# Altium schematic sheet Driver.SchDoc
size A
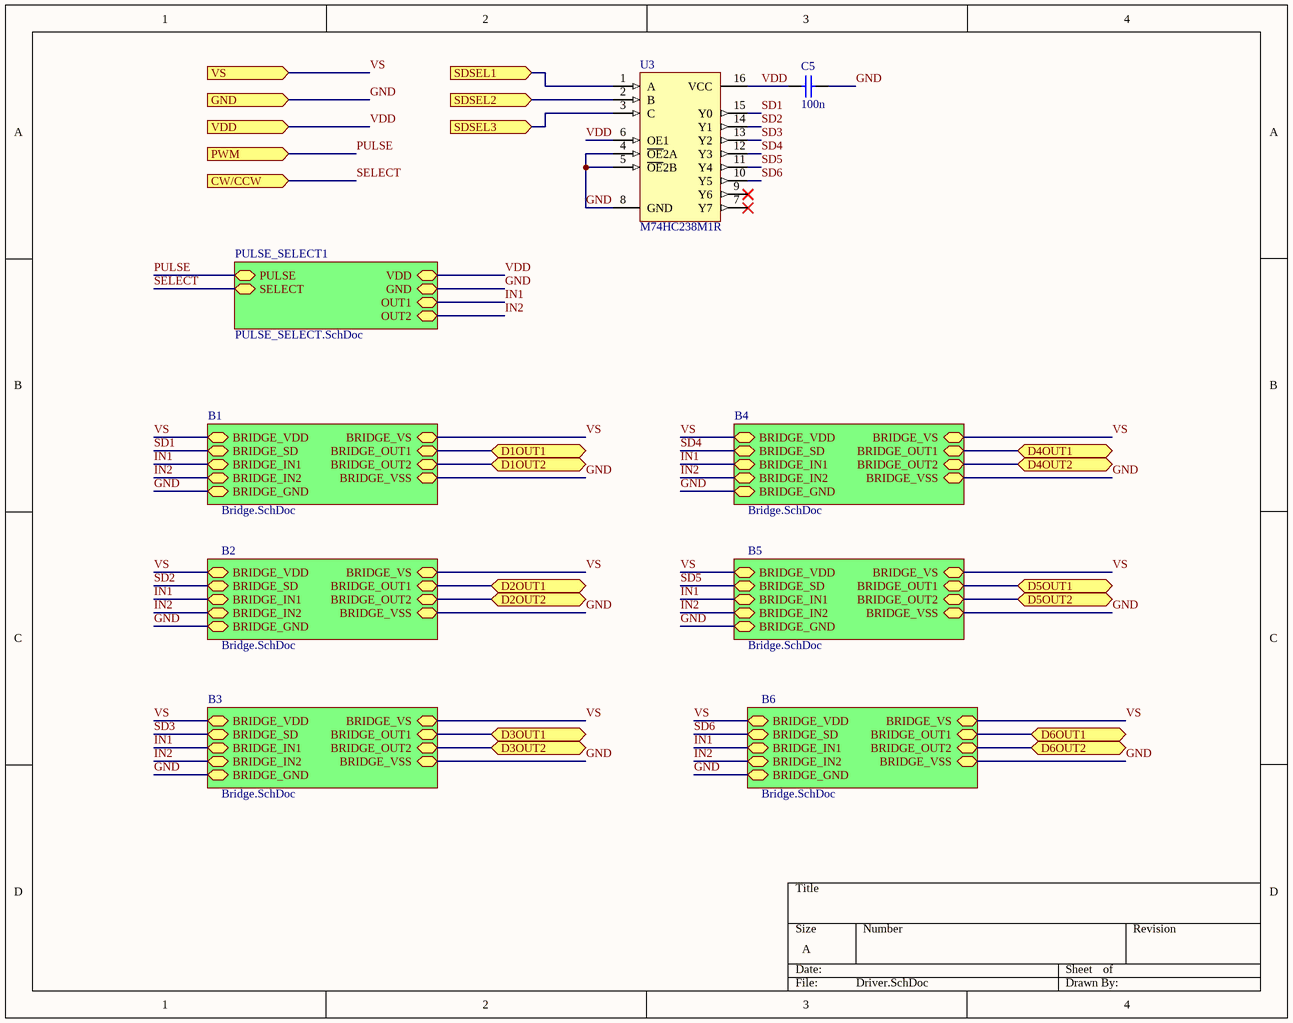
[diagram p0: Driver.SchDoc]

## Parts
C5  100n  [MY_CAP_SMD_0805]
U3  M74HC238M1R  [SO16_N]

## Sub-sheets
B1 = Bridge.SchDoc: BRIDGE_IN1, BRIDGE_IN2, BRIDGE_VDD, BRIDGE_GND, BRIDGE_VSS, BRIDGE_VS, BRIDGE_OUT1, BRIDGE_OUT2, BRIDGE_SD
B2 = Bridge.SchDoc: BRIDGE_IN1, BRIDGE_IN2, BRIDGE_VDD, BRIDGE_GND, BRIDGE_VSS, BRIDGE_VS, BRIDGE_OUT1, BRIDGE_OUT2, BRIDGE_SD
B3 = Bridge.SchDoc: BRIDGE_IN1, BRIDGE_IN2, BRIDGE_VDD, BRIDGE_GND, BRIDGE_VSS, BRIDGE_VS, BRIDGE_OUT1, BRIDGE_OUT2, BRIDGE_SD
B4 = Bridge.SchDoc: BRIDGE_IN1, BRIDGE_IN2, BRIDGE_VDD, BRIDGE_GND, BRIDGE_VSS, BRIDGE_VS, BRIDGE_OUT1, BRIDGE_OUT2, BRIDGE_SD
B5 = Bridge.SchDoc: BRIDGE_IN1, BRIDGE_IN2, BRIDGE_VDD, BRIDGE_GND, BRIDGE_VSS, BRIDGE_VS, BRIDGE_OUT1, BRIDGE_OUT2, BRIDGE_SD
B6 = Bridge.SchDoc: BRIDGE_IN1, BRIDGE_IN2, BRIDGE_VDD, BRIDGE_GND, BRIDGE_VSS, BRIDGE_VS, BRIDGE_OUT1, BRIDGE_OUT2, BRIDGE_SD
PULSE_SELECT1 = PULSE_SELECT.SchDoc: VDD, GND, OUT1, OUT2, PULSE, SELECT

## Ports
CW/CCW (in), D1OUT1, D1OUT2, D2OUT1, D2OUT2, D3OUT1, D3OUT2, D4OUT1, D4OUT2, D5OUT1, D5OUT2, D6OUT1, D6OUT2, GND (in), PWM (in), SDSEL1 (in), SDSEL2 (in), SDSEL3 (in), VDD (in), VS (in)

## Nets
D1OUT1: port D1OUT1, sheet B1/BRIDGE_OUT1
D1OUT2: port D1OUT2, sheet B1/BRIDGE_OUT2
D2OUT1: port D2OUT1, sheet B2/BRIDGE_OUT1
D2OUT2: port D2OUT2, sheet B2/BRIDGE_OUT2
D3OUT1: port D3OUT1, sheet B3/BRIDGE_OUT1
D3OUT2: port D3OUT2, sheet B3/BRIDGE_OUT2
D4OUT1: port D4OUT1, sheet B4/BRIDGE_OUT1
D4OUT2: port D4OUT2, sheet B4/BRIDGE_OUT2
D5OUT1: port D5OUT1, sheet B5/BRIDGE_OUT1
D5OUT2: port D5OUT2, sheet B5/BRIDGE_OUT2
D6OUT1: port D6OUT1, sheet B6/BRIDGE_OUT1
D6OUT2: port D6OUT2, sheet B6/BRIDGE_OUT2
GND: C5.1 U3.4(~{OE}2A) U3.5(~{OE}2B) U3.8(GND) ; port GND, sheet B1/BRIDGE_GND, sheet B1/BRIDGE_VSS, sheet PULSE_SELECT1/GND, sheet B2/BRIDGE_GND, sheet B2/BRIDGE_VSS, sheet B3/BRIDGE_GND, sheet B3/BRIDGE_VSS, sheet B6/BRIDGE_GND, sheet B6/BRIDGE_VSS, sheet B4/BRIDGE_GND, sheet B4/BRIDGE_VSS, sheet B5/BRIDGE_GND, sheet B5/BRIDGE_VSS
IN1: sheet B1/BRIDGE_IN1, sheet PULSE_SELECT1/OUT1, sheet B2/BRIDGE_IN1, sheet B3/BRIDGE_IN1, sheet B6/BRIDGE_IN1, sheet B4/BRIDGE_IN1, sheet B5/BRIDGE_IN1
IN2: sheet B1/BRIDGE_IN2, sheet PULSE_SELECT1/OUT2, sheet B2/BRIDGE_IN2, sheet B3/BRIDGE_IN2, sheet B6/BRIDGE_IN2, sheet B4/BRIDGE_IN2, sheet B5/BRIDGE_IN2
PULSE: port PWM, sheet PULSE_SELECT1/PULSE
SD1: U3.15(Y0) ; sheet B1/BRIDGE_SD
SD2: U3.14(Y1) ; sheet B2/BRIDGE_SD
SD3: U3.13(Y2) ; sheet B3/BRIDGE_SD
SD4: U3.12(Y3) ; sheet B4/BRIDGE_SD
SD5: U3.11(Y4) ; sheet B5/BRIDGE_SD
SD6: U3.10(Y5) ; sheet B6/BRIDGE_SD
SDSEL1: U3.1(A) ; port SDSEL1
SDSEL2: U3.2(B) ; port SDSEL2
SDSEL3: U3.3(C) ; port SDSEL3
SELECT: port CW/CCW, sheet PULSE_SELECT1/SELECT
VDD: C5.2 U3.6(OE1) U3.16(VCC) ; port VDD, sheet PULSE_SELECT1/VDD
VS: port VS, sheet B1/BRIDGE_VDD, sheet B1/BRIDGE_VS, sheet B2/BRIDGE_VDD, sheet B2/BRIDGE_VS, sheet B3/BRIDGE_VDD, sheet B3/BRIDGE_VS, sheet B6/BRIDGE_VDD, sheet B6/BRIDGE_VS, sheet B4/BRIDGE_VDD, sheet B4/BRIDGE_VS, sheet B5/BRIDGE_VDD, sheet B5/BRIDGE_VS

Not connected (* = marked no-connect by the designer): U3 7(Y7)* 9(Y6)*

## Library data of the parts
C5 = CAP SMD
U3 = M74HC238M1R: 3-to-8 Line Decoder; Published: 8-Jun-2000; LatestRevisionDate: 13-Apr-2006; LatestRevisionNote: IPC-7351 Footprint Added.; DatasheetVersion: Oct-1993; PackageVersion: May-1998; PackageReference: SO16; Publisher: Altium Limited; PackageDescription: 16-Pin Small Outline Integrated Circuit 1.27 mm Pitch; Code_IPC: SOIC127P600-16; ComponentLink1Description: Manufacturer Link; ComponentLink1URL: http://www.st.com/; ComponentLink2Description: Datasheet; ComponentLink2URL: http://www.st.com/stonline/products/literature/ds/1926/m74hc238.pdf